# Altium schematic sheet PlausibilityTrigger.SchDoc
size A
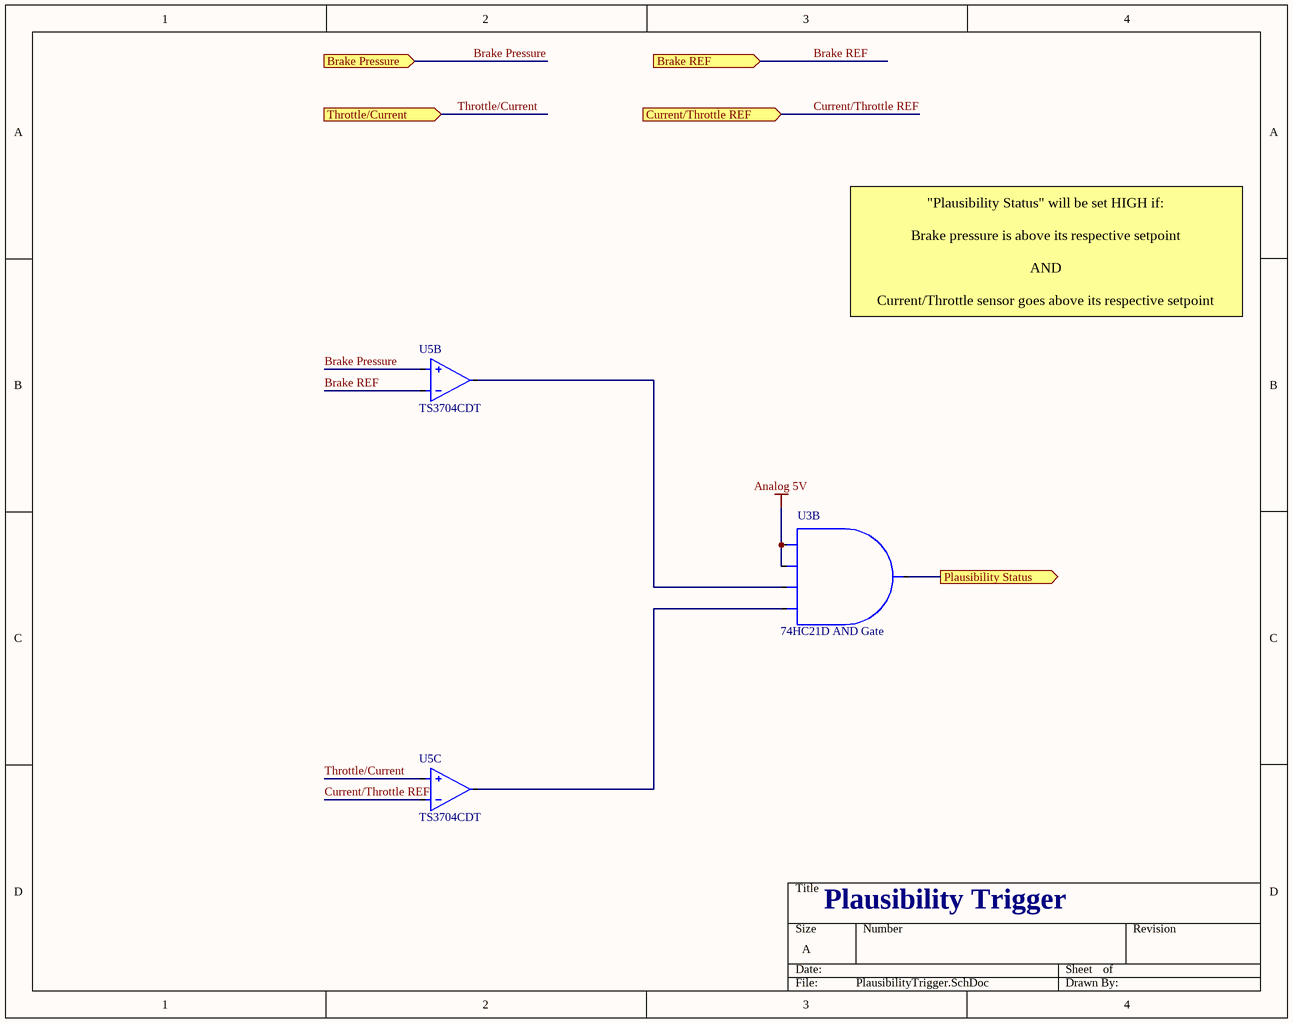
[diagram p0: PlausibilityTrigger.SchDoc]

## Parts
U3  74HC21D AND Gate  [SOT108-1]  (part B of 2)
U5  TS3704CDT  [SOIC-14]  (parts B,C of 4)

## Ports
Brake Pressure (in), Brake REF (in), Current/Throttle REF (in), Plausibility Status (out), Throttle/Current (in)

## Nets
Analog 5V: U3.9(2A) U3.10(2B)
Brake Pressure: U5.7(+IN_2) ; port Brake Pressure
Brake REF: U5.6(-IN_2) ; port Brake REF
Current/Throttle REF: U5.8(-IN_3) ; port Current/Throttle REF
Plausibility Status: U3.8(2Y) ; port Plausibility Status
Throttle/Current: U5.9(+IN_3) ; port Throttle/Current
NetU3_12: U3.12(2C) U5.1(OUT_2)
NetU3_13: U3.13(2D) U5.14(OUT_3)

## Notes on the sheet
- "Plausibility Status" will be set HIGH if:
  Brake pressure is above its respective setpoint
  AND
  Current/Throttle sensor goes above its respective setpoint
- Plausibility Trigger

## Library data of the parts
U3 = 15: 74HC21D_AND_Gate; id: 15; DualAND: Plaus+BSPDAND; quantity: 0
U5 = 42: Quad CMOS Comparators; id: 42; vcc: 18; voltageinmax: 12; AnnotateREF: BSPD_Trig; name: TS3704CDT; package: SOIC-14; quantity: 0; link: https://www.digikey.com/product-detail/en/stmicroelectronics/TS3704CDT/497-4063-1-ND/720983; createdby: Kevin